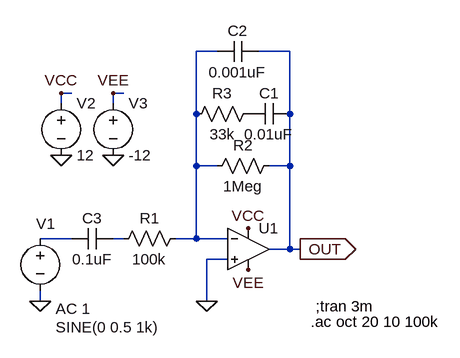
[diagram p0: schematic pink_noise_analog2_0.asc]
pink_noise_analog2_0.asc, the LTspice schematic file:
Version 4
SHEET 1 880 680
WIRE 288 -144 256 -144
WIRE 400 -144 352 -144
WIRE 64 -80 48 -80
WIRE 144 -80 128 -80
WIRE 48 -64 48 -80
WIRE 128 -64 128 -80
WIRE 256 -48 256 -144
WIRE 400 -48 400 -144
WIRE 256 32 256 -48
WIRE 288 32 256 32
WIRE 400 32 400 -48
WIRE 400 32 368 32
WIRE 64 144 16 144
WIRE 144 144 128 144
WIRE 256 144 256 32
WIRE 256 144 224 144
WIRE 304 144 256 144
WIRE 400 160 400 32
WIRE 400 160 368 160
WIRE 416 160 400 160
WIRE 304 176 272 176
WIRE 16 240 16 224
WIRE 272 240 272 176
FLAG 336 128 VCC
FLAG 336 192 VEE
FLAG 16 240 0
FLAG 416 160 OUT
IOPIN 416 160 Out
FLAG 48 -80 VCC
FLAG 128 -80 VEE
FLAG 48 16 0
FLAG 128 16 0
FLAG 272 240 0
SYMBOL res 240 128 R90
WINDOW 0 0 56 VBottom 2
WINDOW 3 32 56 VTop 2
SYMATTR InstName R1
SYMATTR Value 100k
SYMBOL res 384 16 R90
WINDOW 0 0 56 VBottom 2
WINDOW 3 32 56 VTop 2
SYMATTR InstName R2
SYMATTR Value 1Meg
SYMBOL res 352 -64 R90
WINDOW 0 0 56 VBottom 2
WINDOW 3 32 56 VTop 2
SYMATTR InstName R3
SYMATTR Value 33k
SYMBOL cap 400 -64 R90
WINDOW 0 0 32 VBottom 2
WINDOW 3 32 32 VTop 2
SYMATTR InstName C1
SYMATTR Value 0.01uF
SYMBOL cap 352 -160 R90
WINDOW 0 0 32 VBottom 2
WINDOW 3 32 32 VTop 2
SYMATTR InstName C2
SYMATTR Value 0.001uF
SYMBOL Opamps\\UniversalOpamp2 336 160 R0
SYMATTR InstName U1
SYMBOL voltage 16 128 R0
WINDOW 0 -6 -7 Left 2
WINDOW 3 24 152 Left 2
WINDOW 123 24 124 Left 2
WINDOW 39 0 0 Left 2
SYMATTR InstName V1
SYMATTR Value SINE(0 0.5 1k)
SYMATTR Value2 AC 1
SYMBOL voltage 48 -80 R0
SYMATTR InstName V2
SYMATTR Value 12
SYMBOL voltage 128 -80 R0
WINDOW 123 0 0 Left 2
WINDOW 39 0 0 Left 2
SYMATTR InstName V3
SYMATTR Value -12
SYMBOL cap 128 128 R90
WINDOW 0 0 32 VBottom 2
WINDOW 3 32 32 VTop 2
SYMATTR InstName C3
SYMATTR Value 0.1uF
TEXT 440 248 Left 2 !;tran 3m
TEXT 432 272 Left 2 !.ac oct 20 10 100k

The netlist it stands for:
* pink_noise_analog2_0.asc
R1 N001 N003 100k
R2 OUT N001 1Meg
R3 P001 N001 33k
C1 OUT P001 0.01uF
C2 OUT N001 0.001uF
XU1 0 N001 VCC VEE OUT level.2 Avol=1Meg GBW=10Meg Slew=10Meg ilimit=25m rail=0 Vos=0 phimargin=45 en=0 enk=0 in=0 ink=0 Rin=500Meg  ; pins IN+ IN- V+ V- OUT
V1 N002 0 SINE(0 0.5 1k) AC 1
V2 VCC 0 12
V3 VEE 0 -12
C3 N003 N002 0.1uF
;tran 3m
.ac oct 20 10 100k
.lib UniversalOpamps2.sub
.backanno
.end